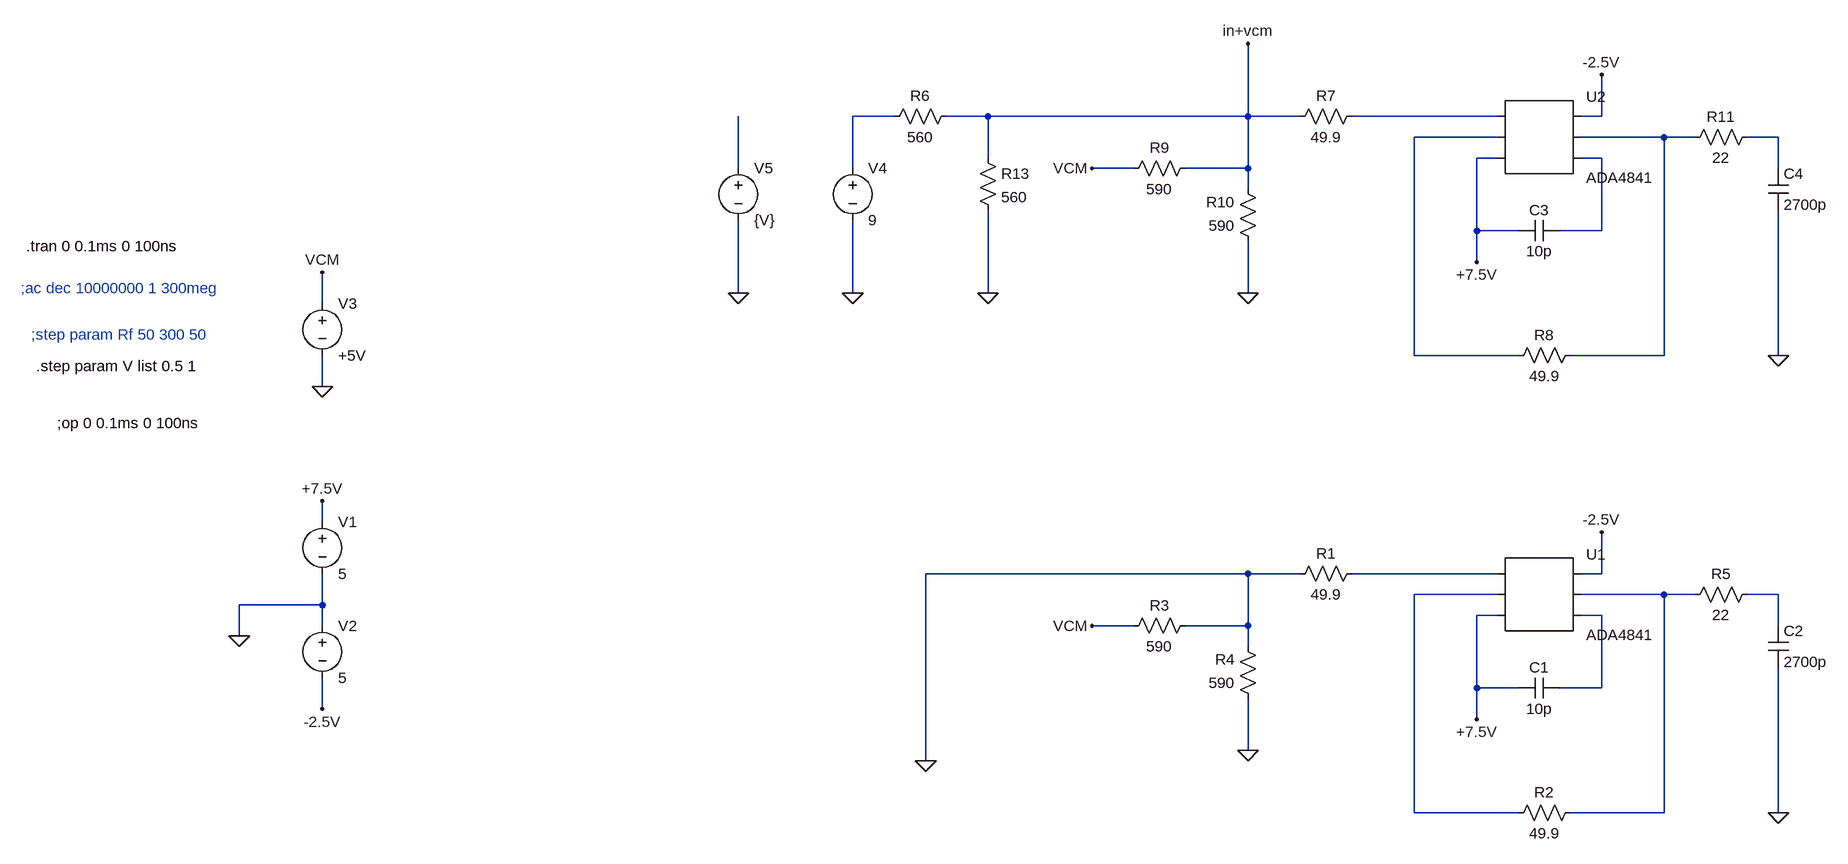
[diagram p0: schematic ad_7982_time.asc]
ad_7982_time.asc, the LTspice schematic file:
Version 4
SHEET 1 3988 680
WIRE 944 -2768 880 -2768
WIRE 1088 -2768 1024 -2768
WIRE 1488 -2768 1488 -2880
WIRE 1488 -2768 1088 -2768
WIRE 1568 -2768 1488 -2768
WIRE 1872 -2768 1648 -2768
WIRE 2032 -2768 2032 -2832
WIRE 2032 -2768 2000 -2768
WIRE 1872 -2736 1744 -2736
WIRE 2128 -2736 2000 -2736
WIRE 2176 -2736 2128 -2736
WIRE 2304 -2736 2256 -2736
WIRE 1088 -2704 1088 -2768
WIRE 1872 -2704 1840 -2704
WIRE 2032 -2704 2000 -2704
WIRE 704 -2688 704 -2768
WIRE 880 -2688 880 -2768
WIRE 1312 -2688 1248 -2688
WIRE 1488 -2688 1488 -2768
WIRE 1488 -2688 1392 -2688
WIRE 2304 -2688 2304 -2736
WIRE 1488 -2656 1488 -2688
WIRE 1840 -2592 1840 -2704
WIRE 1904 -2592 1840 -2592
WIRE 2032 -2592 2032 -2704
WIRE 2032 -2592 1968 -2592
WIRE 1840 -2544 1840 -2592
WIRE 704 -2496 704 -2608
WIRE 880 -2496 880 -2608
WIRE 1088 -2496 1088 -2624
WIRE 1488 -2496 1488 -2576
WIRE 64 -2480 64 -2528
WIRE 1744 -2400 1744 -2736
WIRE 1904 -2400 1744 -2400
WIRE 2128 -2400 2128 -2736
WIRE 2128 -2400 1984 -2400
WIRE 2304 -2400 2304 -2624
WIRE 64 -2352 64 -2400
WIRE 64 -2144 64 -2176
WIRE 1488 -2064 992 -2064
WIRE 1568 -2064 1488 -2064
WIRE 1872 -2064 1648 -2064
WIRE 2032 -2064 2032 -2128
WIRE 2032 -2064 2000 -2064
WIRE 1872 -2032 1744 -2032
WIRE 2128 -2032 2000 -2032
WIRE 2176 -2032 2128 -2032
WIRE 2304 -2032 2256 -2032
WIRE 64 -2016 64 -2064
WIRE 64 -2016 -64 -2016
WIRE 1872 -2000 1840 -2000
WIRE 2032 -2000 2000 -2000
WIRE 64 -1984 64 -2016
WIRE 1312 -1984 1248 -1984
WIRE 1488 -1984 1488 -2064
WIRE 1488 -1984 1392 -1984
WIRE 2304 -1984 2304 -2032
WIRE -64 -1968 -64 -2016
WIRE 1488 -1952 1488 -1984
WIRE 1840 -1888 1840 -2000
WIRE 1904 -1888 1840 -1888
WIRE 2032 -1888 2032 -2000
WIRE 2032 -1888 1968 -1888
WIRE 64 -1856 64 -1904
WIRE 1840 -1840 1840 -1888
WIRE 1488 -1792 1488 -1872
WIRE 992 -1776 992 -2064
WIRE 1744 -1696 1744 -2032
WIRE 1904 -1696 1744 -1696
WIRE 2128 -1696 2128 -2032
WIRE 2128 -1696 1984 -1696
WIRE 2304 -1696 2304 -1920
FLAG -64 -1968 0
FLAG 64 -2176 +7.5V
FLAG 64 -1856 -2.5V
FLAG 64 -2528 VCM
FLAG 64 -2352 0
FLAG 2032 -2128 -2.5V
FLAG 1840 -1840 +7.5V
FLAG 1488 -1792 0
FLAG 1248 -1984 VCM
FLAG 2304 -1696 0
FLAG 2032 -2832 -2.5V
FLAG 1840 -2544 +7.5V
FLAG 1488 -2496 0
FLAG 1248 -2688 VCM
FLAG 704 -2496 0
FLAG 2304 -2400 0
FLAG 992 -1776 0
FLAG 1488 -2880 in+vcm
FLAG 880 -2496 0
FLAG 1088 -2496 0
SYMBOL voltage 64 -2160 R0
WINDOW 123 0 0 Left 0
WINDOW 39 0 0 Left 0
SYMATTR InstName V1
SYMATTR Value 5
SYMBOL voltage 64 -2000 R0
WINDOW 123 0 0 Left 0
WINDOW 39 0 0 Left 0
SYMATTR InstName V2
SYMATTR Value 5
SYMBOL voltage 64 -2496 R0
WINDOW 123 0 0 Left 0
WINDOW 39 0 0 Left 0
SYMATTR InstName V3
SYMATTR Value +5V
SYMBOL AutoGenerated\\ADA4841 1936 -2032 R0
SYMATTR InstName U1
SYMBOL res 1664 -2080 R90
WINDOW 0 0 56 VBottom 2
WINDOW 3 32 56 VTop 2
SYMATTR InstName R1
SYMATTR Value 49.9
SYMBOL res 2000 -1712 R90
WINDOW 0 0 56 VBottom 2
WINDOW 3 32 56 VTop 2
SYMATTR InstName R2
SYMATTR Value 49.9
SYMBOL res 1408 -2000 R90
WINDOW 0 0 56 VBottom 2
WINDOW 3 32 56 VTop 2
SYMATTR InstName R3
SYMATTR Value 590
SYMBOL res 1504 -1856 R180
WINDOW 0 36 76 Left 2
WINDOW 3 36 40 Left 2
SYMATTR InstName R4
SYMATTR Value 590
SYMBOL cap 1968 -1904 R90
WINDOW 0 0 32 VBottom 2
WINDOW 3 32 32 VTop 2
SYMATTR InstName C1
SYMATTR Value 10p
SYMBOL res 2272 -2048 R90
WINDOW 0 0 56 VBottom 2
WINDOW 3 32 56 VTop 2
SYMATTR InstName R5
SYMATTR Value 22
SYMBOL cap 2288 -1984 R0
SYMATTR InstName C2
SYMATTR Value 2700p
SYMBOL AutoGenerated\\ADA4841 1936 -2736 R0
SYMATTR InstName U2
SYMBOL res 1664 -2784 R90
WINDOW 0 0 56 VBottom 2
WINDOW 3 32 56 VTop 2
SYMATTR InstName R7
SYMATTR Value 49.9
SYMBOL res 2000 -2416 R90
WINDOW 0 0 56 VBottom 2
WINDOW 3 32 56 VTop 2
SYMATTR InstName R8
SYMATTR Value 49.9
SYMBOL res 1408 -2704 R90
WINDOW 0 0 56 VBottom 2
WINDOW 3 32 56 VTop 2
SYMATTR InstName R9
SYMATTR Value 590
SYMBOL res 1504 -2560 R180
WINDOW 0 36 76 Left 2
WINDOW 3 36 40 Left 2
SYMATTR InstName R10
SYMATTR Value 590
SYMBOL cap 1968 -2608 R90
WINDOW 0 0 32 VBottom 2
WINDOW 3 32 32 VTop 2
SYMATTR InstName C3
SYMATTR Value 10p
SYMBOL voltage 704 -2704 R0
WINDOW 123 0 0 Left 0
WINDOW 39 0 0 Left 0
SYMATTR InstName V5
SYMATTR Value {V}
SYMBOL res 2272 -2752 R90
WINDOW 0 0 56 VBottom 2
WINDOW 3 32 56 VTop 2
SYMATTR InstName R11
SYMATTR Value 22
SYMBOL cap 2288 -2688 R0
SYMATTR InstName C4
SYMATTR Value 2700p
SYMBOL voltage 880 -2704 R0
WINDOW 123 0 0 Left 0
WINDOW 39 0 0 Left 0
SYMATTR InstName V4
SYMATTR Value 9
SYMBOL res 1040 -2784 R90
WINDOW 0 0 56 VBottom 2
WINDOW 3 32 56 VTop 2
SYMATTR InstName R6
SYMATTR Value 560
SYMBOL res 1072 -2720 R0
SYMATTR InstName R13
SYMATTR Value 560
TEXT -400 -2504 Left 2 ;;ac dec 10000000 1 300meg
TEXT -392 -2568 Left 2 !.tran 0 0.1ms 0 100ns
TEXT -384 -2432 Left 2 ;;step param Rf 50 300 50
TEXT -376 -2384 Left 2 !.step param V list 0.5 1
TEXT -344 -2296 Left 2 !;op 0 0.1ms 0 100ns

The netlist it stands for:
* ad_7982_time.asc
V1 +7.5V 0 5
V2 0 -2.5V 5
V3 VCM 0 +5V
* U1: ADA4841 (symbol AutoGenerated\ADA4841 not available, pins judged from their places): pin1=N008 pin2=N009 pin3=+7.5V pin4=-2.5V pin5=N010 pin6=N012
R1 N008 0 49.9
R2 N010 N009 49.9
R3 0 VCM 590
R4 0 0 590
C1 N012 +7.5V 10p
R5 N011 N010 22
C2 N011 0 2700p
* U2: ADA4841 (symbol AutoGenerated\ADA4841 not available, pins judged from their places): pin1=N002 pin2=N003 pin3=+7.5V pin4=-2.5V pin5=N004 pin6=N006
R7 N002 in+vcm 49.9
R8 N004 N003 49.9
R9 in+vcm VCM 590
R10 0 in+vcm 590
C3 N006 +7.5V 10p
V5 N007 0 {V}
R11 N005 N004 22
C4 N005 0 2700p
V4 N001 0 9
R6 in+vcm N001 560
R13 in+vcm 0 560
* ;ac dec 10000000 1 300meg
.tran 0 0.1ms 0 100ns
* ;step param Rf 50 300 50
.step param V list 0.5 1
;op 0 0.1ms 0 100ns
.backanno
.end